# EAGLE design vco1_pots (EAGLE 7.6.0)
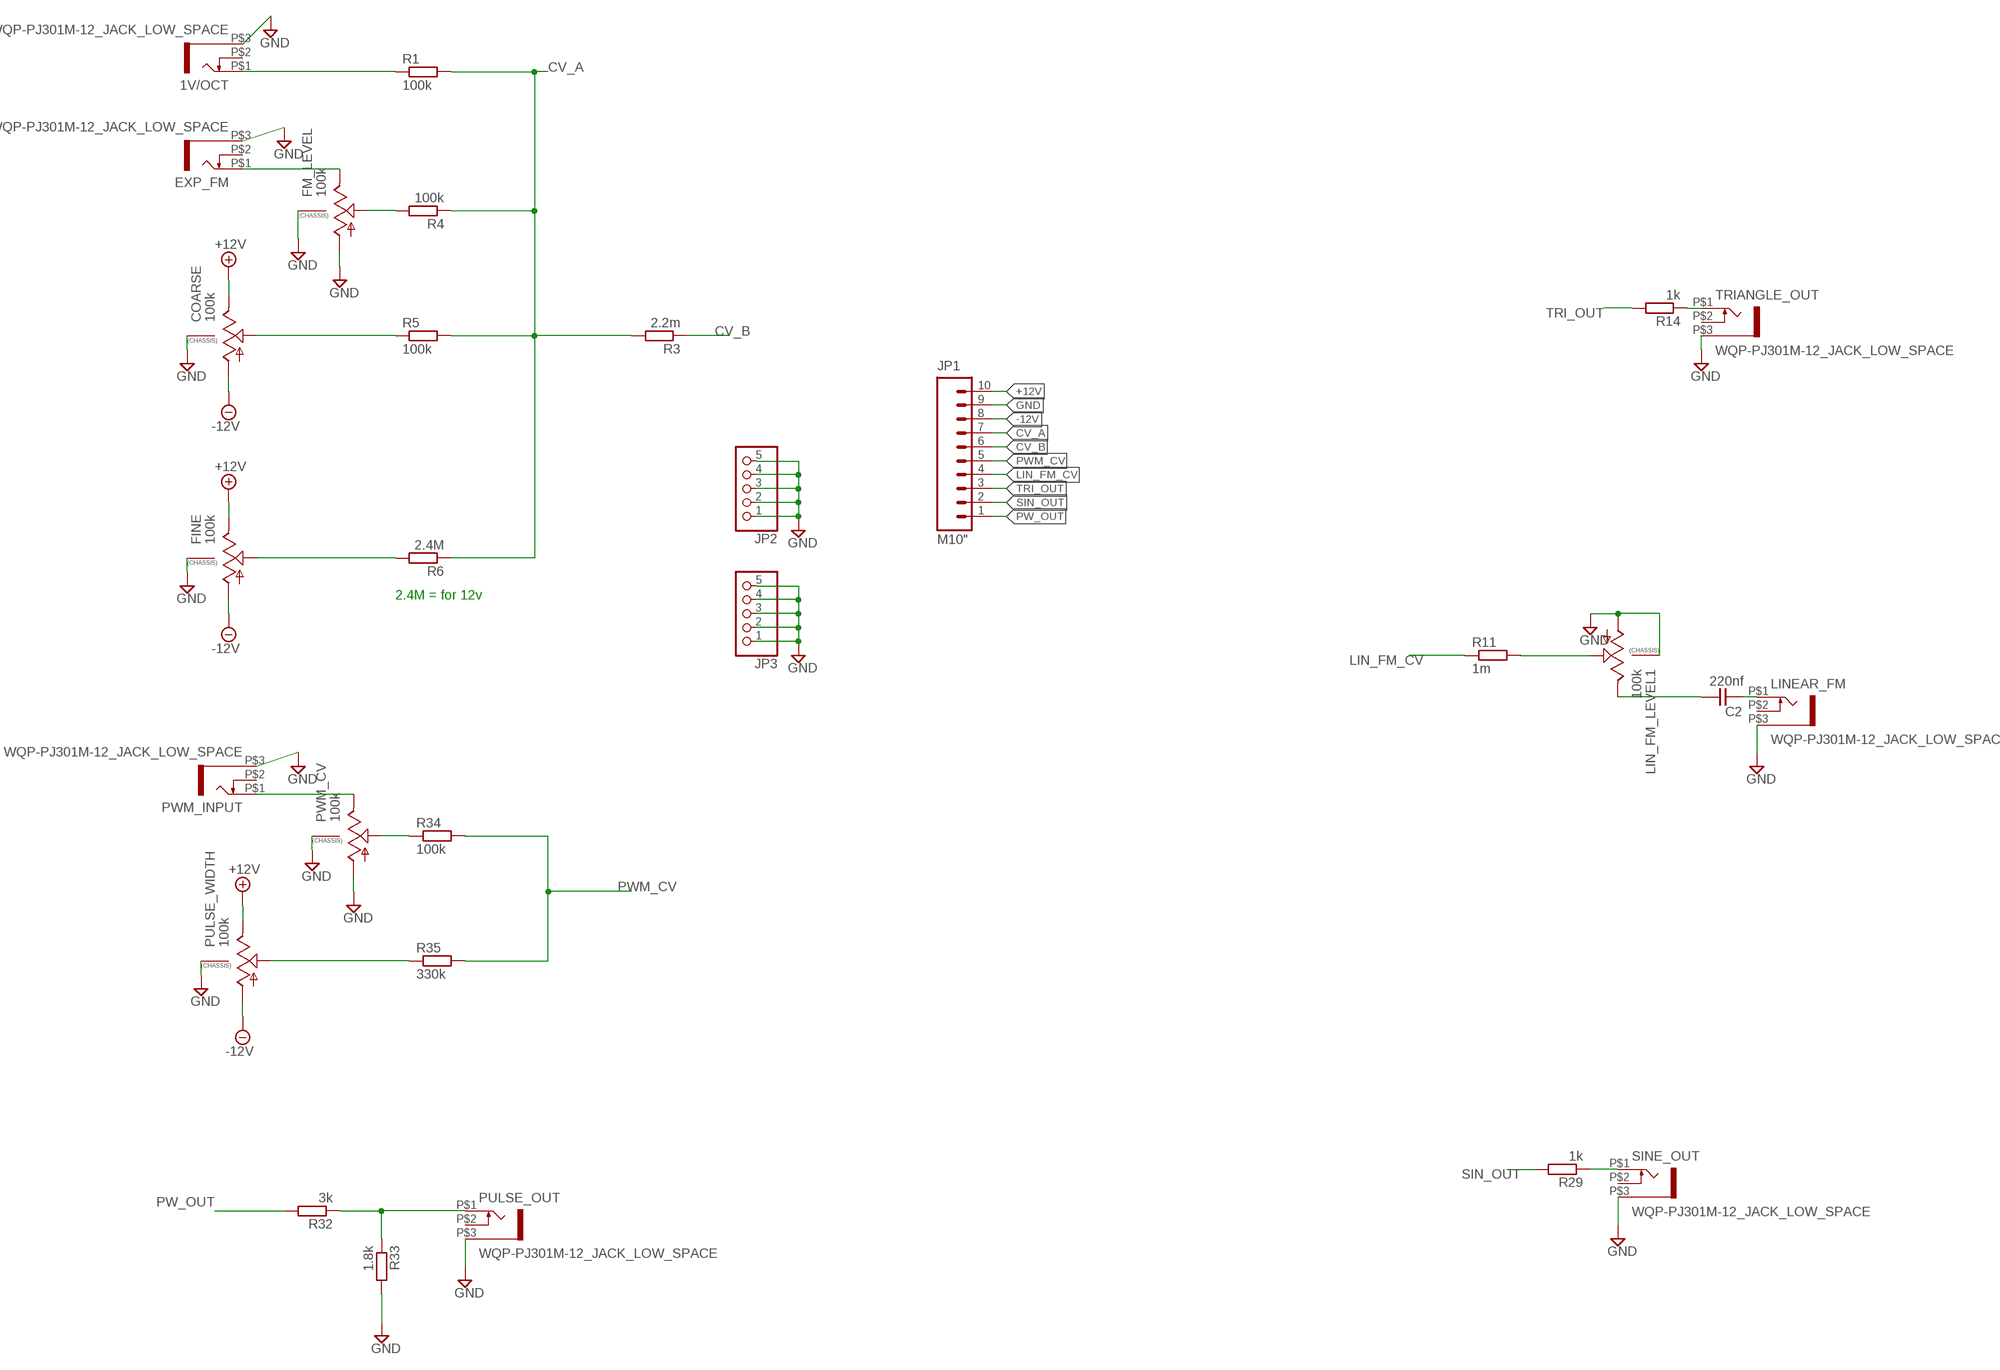
[diagram p0: schematic, sheet 1]

## Parts
1V/OCT  WQP-PJ301M-12_JACK_LOW_SPACE  [WQP-PJ301M-12_JACK_LOW_SPACE]
C2  220nf  C-EU050-024X044  [C050-024X044]
COARSE  100k  9MM_SNAP-IN_POT_CHASSIS  [9MM_SNAP-IN_POT]
EXP_FM  WQP-PJ301M-12_JACK_LOW_SPACE  [WQP-PJ301M-12_JACK_LOW_SPACE]
FINE  100k  9MM_SNAP-IN_POT_CHASSIS  [9MM_SNAP-IN_POT]
FM_LEVEL  100k  9MM_SNAP-IN_POT_CHASSIS  [9MM_SNAP-IN_POT]
JP1  M10"  [1X10]
JP2  PINHD-1X55X2MM  [1_05X2MM]
JP3  PINHD-1X55X2MM  [1_05X2MM]
LIN_FM_LEVEL1  100k  9MM_SNAP-IN_POT_CHASSIS  [9MM_SNAP-IN_POT]
LINEAR_FM  WQP-PJ301M-12_JACK_LOW_SPACE  [WQP-PJ301M-12_JACK_LOW_SPACE]
PULSE_OUT  WQP-PJ301M-12_JACK_LOW_SPACE  [WQP-PJ301M-12_JACK_LOW_SPACE]
PULSE_WIDTH  100k  9MM_SNAP-IN_POT_CHASSIS  [9MM_SNAP-IN_POT]
PWM_CV  100k  9MM_SNAP-IN_POT_CHASSIS  [9MM_SNAP-IN_POT]
PWM_INPUT  WQP-PJ301M-12_JACK_LOW_SPACE  [WQP-PJ301M-12_JACK_LOW_SPACE]
R1  100k  RESISTOR7MM  [7MM_RESISTOR]
R3  2.2m  RESISTOR7MM  [7MM_RESISTOR]
R4  100k  RESISTOR7MM  [7MM_RESISTOR]
R5  100k  RESISTOR7MM  [7MM_RESISTOR]
R6  2.4M  RESISTOR7MM  [7MM_RESISTOR]
R11  1m  RESISTOR7MM  [7MM_RESISTOR]
R14  1k  RESISTOR7MM  [7MM_RESISTOR]
R29  1k  RESISTOR7MM  [7MM_RESISTOR]
R32  3k  RESISTOR7MM  [7MM_RESISTOR]
R33  1.8k  RESISTOR7MM  [7MM_RESISTOR]
R34  100k  RESISTOR7MM  [7MM_RESISTOR]
R35  330k  RESISTOR7MM  [7MM_RESISTOR]
SINE_OUT  WQP-PJ301M-12_JACK_LOW_SPACE  [WQP-PJ301M-12_JACK_LOW_SPACE]
TRIANGLE_OUT  WQP-PJ301M-12_JACK_LOW_SPACE  [WQP-PJ301M-12_JACK_LOW_SPACE]

## Nets
+12V: COARSE.3(E) FINE.3(E) JP1.10 PULSE_WIDTH.3(E)
-12V: COARSE.1(A) FINE.1(A) JP1.8 PULSE_WIDTH.1(A)
CV_A: JP1.7 R1.2 R3.2 R4.1 R5.2 R6.1
CV_B: JP1.6 R3.1
GND: 1V/OCT.P$3 COARSE.CHASSIS2 EXP_FM.P$3 FINE.CHASSIS2 FM_LEVEL.1(A) FM_LEVEL.CHASSIS2 JP1.9 JP2.1 JP2.2 JP2.3 JP2.4 JP2.5 JP3.1 JP3.2 JP3.3 JP3.4 JP3.5 LIN_FM_LEVEL1.1(A) LIN_FM_LEVEL1.CHASSIS2 LINEAR_FM.P$3 PULSE_OUT.P$3 PULSE_WIDTH.CHASSIS2 PWM_CV.1(A) PWM_CV.CHASSIS2 PWM_INPUT.P$3 R33.2 SINE_OUT.P$3 TRIANGLE_OUT.P$3
LIN_FM_CV: JP1.4 R11.1
N$1: 1V/OCT.P$1 R1.1
N$2: EXP_FM.P$1 FM_LEVEL.3(E)
N$3: FM_LEVEL.2(S) R4.2
N$4: COARSE.2(S) R5.1
N$5: FINE.2(S) R6.2
N$17: LIN_FM_LEVEL1.2(S) R11.2
N$18: R14.1 TRIANGLE_OUT.P$1
N$19: C2.1 LIN_FM_LEVEL1.3(E)
N$20: C2.2 LINEAR_FM.P$1
N$37: R29.1 SINE_OUT.P$1
N$41: PULSE_OUT.P$1 R32.1 R33.1
N$42: PWM_CV.3(E) PWM_INPUT.P$1
N$43: PWM_CV.2(S) R34.1
N$44: PULSE_WIDTH.2(S) R35.1
PW_OUT: JP1.1 R32.2
PWM_CV: JP1.5 R34.2 R35.2
SIN_OUT: JP1.2 R29.2
TRI_OUT: JP1.3 R14.2
Unconnected: 1V/OCT.P$2 EXP_FM.P$2 LINEAR_FM.P$2 PULSE_OUT.P$2 PWM_INPUT.P$2 SINE_OUT.P$2 TRIANGLE_OUT.P$2

## Notes on the sheet
- 2.4M = for 12v

## Library data of the parts
1V/OCT EXP_FM LINEAR_FM PULSE_OUT PWM_INPUT SINE_OUT TRIANGLE_OUT = thonkiconn:WQP-PJ301M-12_JACK_LOW_SPACE
C2 = TomW:C-EU: CAPACITOR, European symbol
COARSE FINE FM_LEVEL LIN_FM_LEVEL1 PULSE_WIDTH PWM_CV = MusicThingModular:9MM_SNAP-IN_POT_CHASSIS: 9mm vertical snap-in pot, Alpha / Panasonic style, with a connection to the metal chassis for grounding
JP1 = SparkFun-Connectors:M10: Header 10 Standard 10-pin 0.1" header. Use with straight break away headers (SKU : PRT-00116), right angle break away headers (PRT-00553), swiss pins (PRT-00743), machine pins (PRT-00117), and female headers (PRT-00115).
JP2 JP3 = pinhead:PINHD-1X5: PIN HEADER
R1 R3-R6 R11 R14 R29 R32-R35 = MusicThingModular:RESISTOR: Standard resistor, various versions

## Net classes
1 power: width 0.406 mm
2 ground: width 0.305 mm

## Board
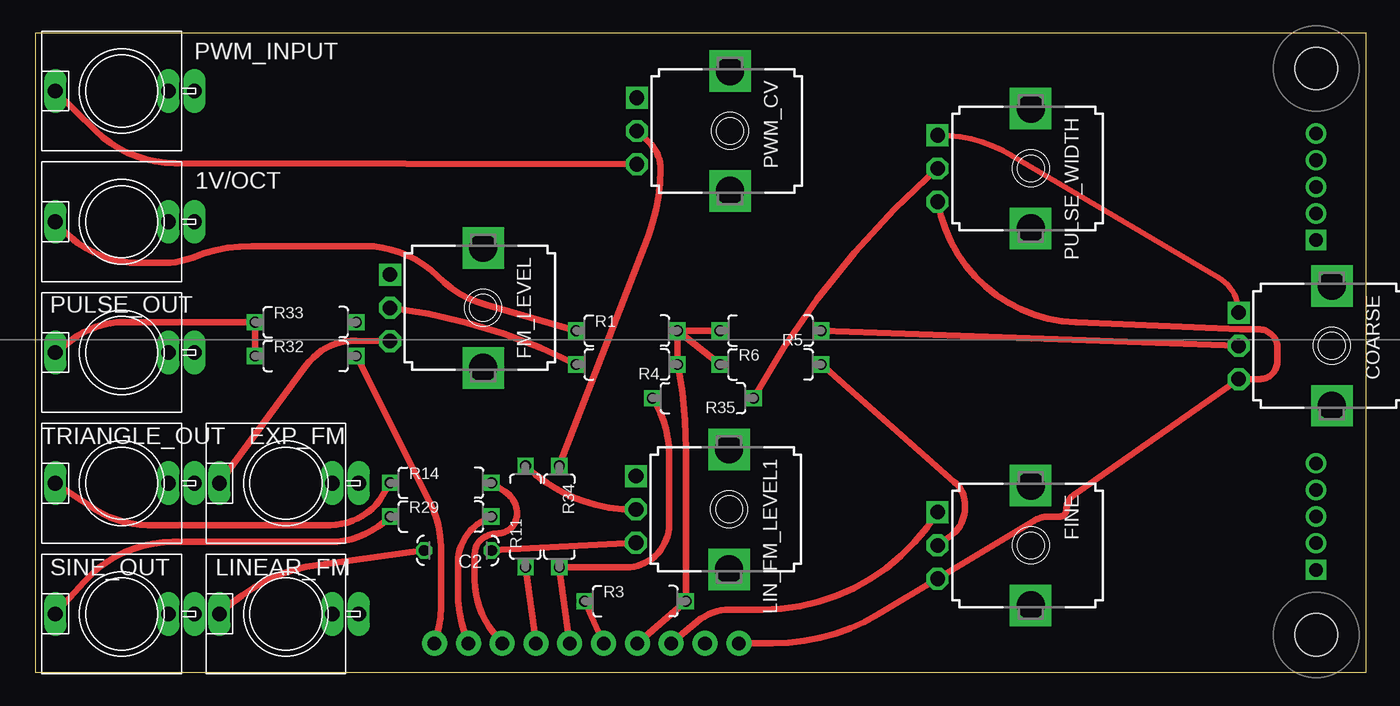
[diagram p1: board, top side]
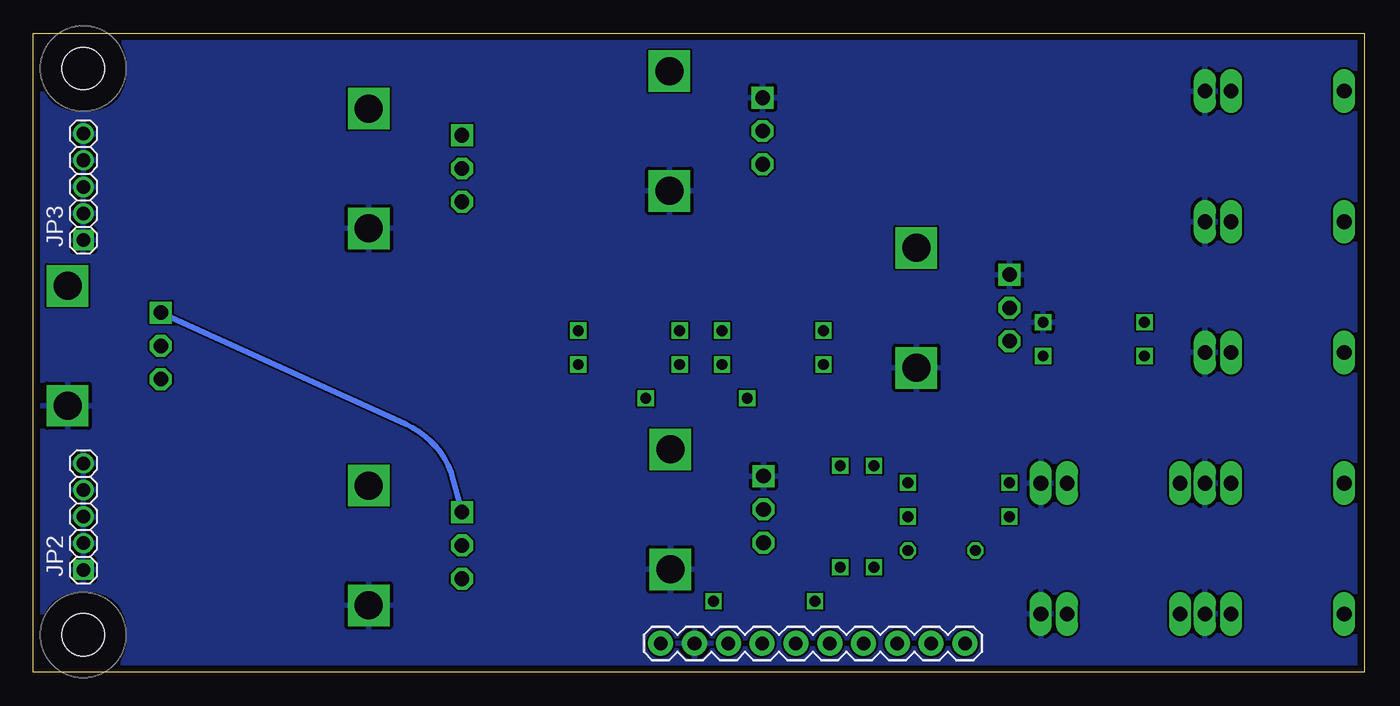
[diagram p2: board, bottom side, seen from below]

Size 100 x 48 mm. Coordinates in mm from the lower left corner, seen from the top.
Outline: 0,0 100,0 100,48 0,48 0,0
Copper layers (1*16): Top 0.035mm / dielectric 1.6mm / Bottom 0.035mm
Design rules "Elecrow_2-layer_PCB_eagle_rule": minimum track width 6mil, minimum drill 12mil, track to track 6mil, track to pad 6mil, pad to pad 6mil, via to via 8mil, smd to smd 0mil, copper to edge 20mil, drill to drill 10mil, minimum pad ring 6mil, minimum via ring 6mil, stop-mask expansion 0mil, vias tented up to drill 100mil, thermal gap 10mil

### Footprints (pad centres in the part's own frame; a part is rotated, then mirrored left to right if it is on the bottom)
WQP-PJ301M-12_JACK_LOW_SPACE = drill 1.1 long: P$1 0,5; P$2 0,-3.5; P$3 0,-5.465
C050-024X044 = drill 0.813 octagon: 1 -2.54,0; 2 2.54,0
9MM_SNAP-IN_POT = drill 1.1 square: 1 -2.5,-7 | drill 1.1 octagon: 2 0,-7; 3 2.5,-7 | drill 2.1 square: CHASSIS1 -4.5,0; CHASSIS2 4.5,0
1X10 = drill 1.016 pad 1.88: 1 0,0; 2 2.54,0; 3 5.08,0; 4 7.62,0; 5 10.16,0; 6 12.7,0; 7 15.24,0; 8 17.78,0; 9 20.32,0; 10 22.86,0
1_05X2MM = drill 1.016 pad 1.3 square: 1 -4,0 | drill 1.016 pad 1.3: 2 0,0; 3 -2,0; 4 2,0; 5 4,0
7MM_RESISTOR = drill 0.813 square: 1 -3.81,0; 2 3.81,0
MOUNTING_HOLE = hole 3.2: 0,0

### Placement (x,y rotation side)
1V/OCT  6.5,33.84 90 top
C2  31.75,9.16 180 top
COARSE  97.42,24.52 270 top
EXP_FM  18.83,14.21 90 top
FINE  74.8,9.53 270 top
FM_LEVEL  33.65,27.38 270 top
JP1  30,2.17 180 bottom
JP2  96.23,11.7 90 bottom
JP3  96.23,36.47 90 bottom
LIN_FM_LEVEL1  52.14,12.24 270 top
LINEAR_FM  18.83,4.39 90 top
PULSE_OUT  6.5,24.03 90 top
PULSE_WIDTH  74.8,37.84 270 top
PWM_CV  52.2,40.66 270 top
PWM_INPUT  6.5,43.66 90 top
R1  44.45,25.67 0 top
R3  45.09,5.35 0 top
R4  44.45,23.13 180 top
R5  55.24,25.67 180 top
R6  55.24,23.13 0 top
R11  36.83,11.7 90 top
R14  30.48,14.24 0 top
R29  30.48,11.7 0 top
R32  20.32,23.77 0 top
R33  20.32,26.3 0 top
R34  39.37,11.7 270 top
R35  50.16,20.59 180 top
SINE_OUT  6.5,4.39 90 top
TRIANGLE_OUT  6.5,14.21 90 top
U$2  [MOUNTING_HOLE]  96.23,2.81 0 top
U$3  [MOUNTING_HOLE]  96.23,45.35 0 top

### Tracks (layer width: path | path; a pad name or v marks a point on that pad's centre or on a via)
+12V
  Top 0.5: JP1.10 55.38,2.17 arc31 63.38,4.39 FINE.3 75.09,11.41 arc-31 76.12,11.7 76.97,11.7 arc90 77.47,12.2 arc-57 78.12,13.39 COARSE.3 92.03,22.03 arc89 93.32,23.32 93.33,24.33 arc87 92,25.76 91.88,25.77 90.57,25.77 78.17,26.28 arc-77 PULSE_WIDTH.3
-12V
  Top 0.406: PULSE_WIDTH.1 arc-31 73.39,38.82 88.92,29.63 arc-59 COARSE.1
  Top 0.5: JP1.8 49.72,3.81 arc-40 52.21,4.71 54.61,4.71 arc58 FINE.1
  Bottom 0.406: COARSE.1 72,18.62 arc52 68.44,14.48 FINE.1
CV_A
  Top 0.5: JP1.7 R3.2 48.9,16.79 arc11 48.27,23.06 R4.1 R1.2 | R1.2 R5.2 | R6.1 R1.2
CV_B
  Top 0.5: JP1.6 R3.1
GND
  pour Bottom: -3.17,56.52 109.86,56.52 109.86,-4.45 -3.17,-4.45
LIN_FM_CV
  Top 0.5: R11.1 JP1.4
N$1
  Top 0.5: R1.1 33.88,27.6 arc-29 30.19,29.77 arc45 24.76,32.02 16.29,32.02 arc22 11.82,31.16 arc-22 9.69,30.75 7.86,30.75 arc-46 2.09,33.22 1V/OCT.P$1
N$2
  Top 0.5: FM_LEVEL.3 24.11,24.91 arc54 20.35,23.05 EXP_FM.P$1
N$3
  Top 0.5: R4.2 arc20 FM_LEVEL.2
N$4
  Top 0.5: R5.1 COARSE.2
N$5
  Top 0.5: FINE.2 68.8,10.28 arc53 69.85,12.38 69.85,12.57 arc49 69.08,14.29 R6.2
N$17
  Top 0.5: LIN_FM_LEVEL1.2 arc-45 R11.2
N$18
  Top 0.5: TRIANGLE_OUT.P$1 4.55,12.23 arc33 8.49,11.06 22.17,11.06 arc59 26.1,13.29 R14.1
N$19
  Top 0.5: C2.1 LIN_FM_LEVEL1.3
N$20
  Top 0.5: C2.2 20.36,7.93 arc29 14.66,5.1 LINEAR_FM.P$1
N$37
  Top 0.5: R29.1 arc-45 22.07,9.79 10.36,9.79 arc48 3.67,6.81 SINE_OUT.P$1
N$41
  Top 0.5: R32.1 R33.1 6.71,26.3 arc38 2.65,24.92 PULSE_OUT.P$1
N$42
  Top 0.5: PWM_INPUT.P$1 4.51,40.7 arc44 10.49,38.24 PWM_CV.3
N$43
  Top 0.5: R34.1 46.06,32.8 arc21 46.99,37.77 arc47 46.08,39.85 PWM_CV.2
N$44
  Top 0.5: R35.1 arc-20 PULSE_WIDTH.2
PW_OUT
  Top 0.5: R32.2 29.73,12.56 arc-27 30.48,9.39 30.48,4.71 arc-14 30.32,3.46 JP1.1
PWM_CV
  Top 0.5: JP1.5 R34.2 44.39,7.89 arc90 47.62,11.13 47.62,16.39 arc34 R35.2
SIN_OUT
  Top 0.5: R29.2 33.74,11.42 arc63 31.75,8.21 31.75,6.14 arc23 JP1.2
TRI_OUT
  Top 0.5: JP1.3 34.42,2.99 arc-39 33.02,6.93 33.02,8.92 arc-63 33.8,10.19 33.91,10.24 arc-27 34.71,10.43 arc90 36.2,11.91 arc56 35.31,13.56 R14.2